# EAGLE design SuperPro (EAGLE 6.6.0)
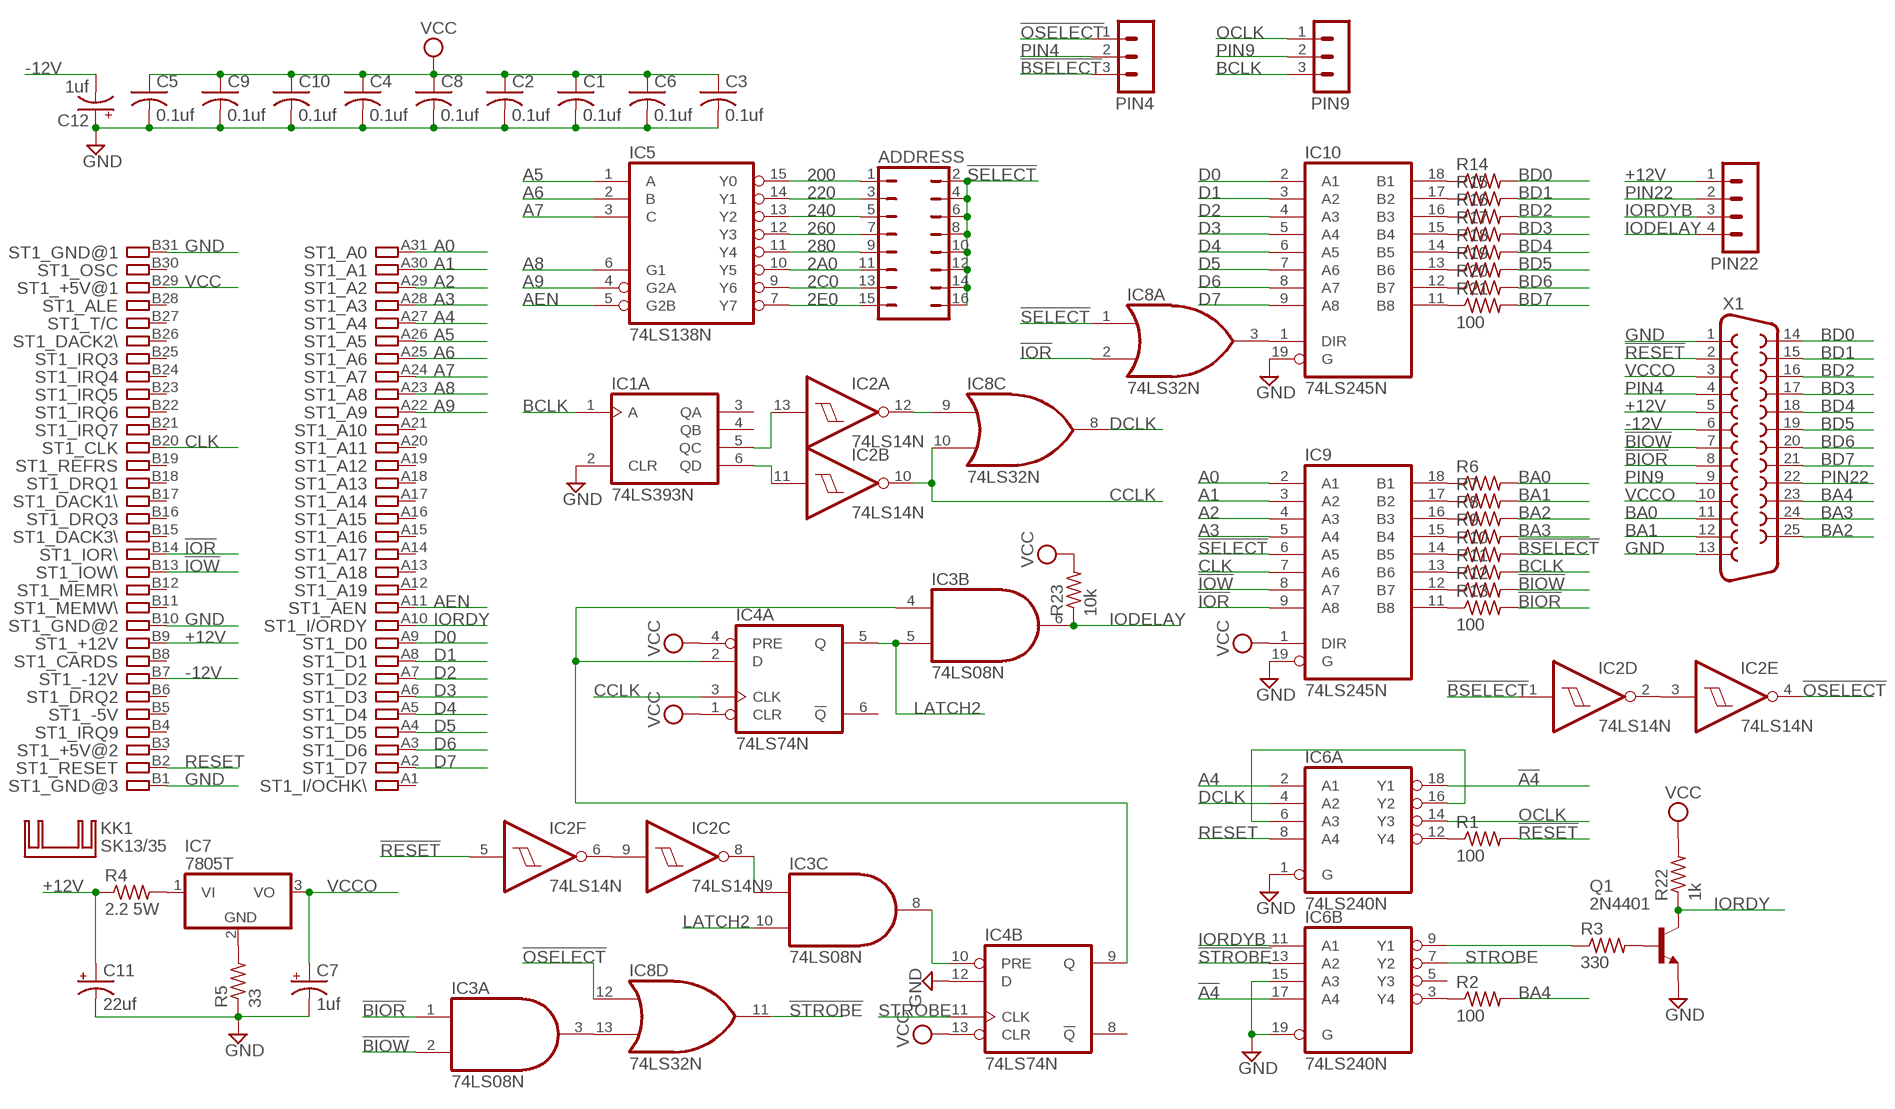
[diagram p0: schematic, sheet 1]

## Parts
ADDRESS  JP8Q  [JP8Q]
C1  0.1uf  C-US050-025X075  [C050-025X075]
C2  0.1uf  C-US050-025X075  [C050-025X075]
C3  0.1uf  C-US050-025X075  [C050-025X075]
C4  0.1uf  C-US050-025X075  [C050-025X075]
C5  0.1uf  C-US050-025X075  [C050-025X075]
C6  0.1uf  C-US050-025X075  [C050-025X075]
C7  1uf  CPOL-USE5-10.5  [E5-10,5]
C8  0.1uf  C-US050-025X075  [C050-025X075]
C9  0.1uf  C-US050-025X075  [C050-025X075]
C10  0.1uf  C-US050-025X075  [C050-025X075]
C11  22uf  CPOL-USE5-10.5  [E5-10,5]
C12  1uf  CPOL-USE5-10.5  [E5-10,5]
IC1  74LS393N  [DIL14]
IC2  74LS14N  [DIL14]
IC3  74LS08N  [DIL14]
IC4  74LS74N  [DIL14]
IC5  74LS138N  [DIL16]
IC6  74LS240N  [DIL20]
IC7  7805T  [TO220H]
IC8  74LS32N  [DIL14]
IC9  74LS245N  [DIL20]
IC10  74LS245N  [DIL20]
KK1  SK13/35  [SK13/35]
PIN4  MA03-1  [MA03-1]
PIN9  MA03-1  [MA03-1]
PIN22  MA04-1  [MA04-1]
Q1  2N4401  2N4416  [TO92]
R1  100  R-US_0207/10  [0207/10]
R2  100  R-US_0207/10  [0207/10]
R3  330  R-US_0207/10  [0207/10]
R4  2.2 5W  R-US_0922/22  [0922/22]
R5  33  R-US_0207/10  [0207/10]
R6  R-US_0207/10  [0207/10]
R7  R-US_0207/10  [0207/10]
R8  R-US_0207/10  [0207/10]
R9  R-US_0207/10  [0207/10]
R10  R-US_0207/10  [0207/10]
R11  R-US_0207/10  [0207/10]
R12  R-US_0207/10  [0207/10]
R13  100  R-US_0207/10  [0207/10]
R14  R-US_0207/10  [0207/10]
R15  R-US_0207/10  [0207/10]
R16  R-US_0207/10  [0207/10]
R17  R-US_0207/10  [0207/10]
R18  R-US_0207/10  [0207/10]
R19  R-US_0207/10  [0207/10]
R20  R-US_0207/10  [0207/10]
R21  100  R-US_0207/10  [0207/10]
R22  1k  R-US_0207/10  [0207/10]
R23  10k  R-US_0207/10  [0207/10]
ST1  IBM8BIT  [IBM8BIT]
X1  F25H  [F25H]

## Nets
2A0: ADDRESS.11 IC5.10(Y5)
2C0: ADDRESS.13 IC5.9(Y6)
2E0: ADDRESS.15 IC5.7(Y7)
200: ADDRESS.1 IC5.15(Y0)
220: ADDRESS.3 IC5.14(Y1)
240: ADDRESS.5 IC5.13(Y2)
260: ADDRESS.7 IC5.12(Y3)
280: ADDRESS.9 IC5.11(Y4)
!A4: IC6.17(B:A4) IC6.18(A:Y1)
!BIOR: IC3.1(A:I0) R13.2 X1.8
!BIOW: IC3.2(A:I1) R12.2 X1.7
!BSELECT: IC2.1(D:I) PIN4.3 R10.2
!IOR: IC8.2(A:I1) IC9.9(A8) ST1.B14
!IOW: IC9.8(A7) ST1.B13
!OSELECT: IC2.4(E:O) IC8.12(D:I0) PIN4.1
!RESET: IC2.5(F:I) R1.2 X1.2
!SELECT: ADDRESS.2 ADDRESS.4 ADDRESS.6 ADDRESS.8 ADDRESS.10 ADDRESS.12 ADDRESS.14 ADDRESS.16 IC8.1(A:I0) IC9.6(A5)
!STROBE: IC6.13(B:A2) IC8.11(D:O)
+12V [Power]: C11.+ PIN22.1 R4.1 ST1.B9 X1.5
-12V [Power]: C12.- ST1.B7 X1.6
A0: IC9.2(A1) ST1.A31
A1: IC9.3(A2) ST1.A30
A2: IC9.4(A3) ST1.A29
A3: IC9.5(A4) ST1.A28
A4: IC6.2(A:A1) ST1.A27
A5: IC5.1(A) ST1.A26
A6: IC5.2(B) ST1.A25
A7: IC5.3(C) ST1.A24
A8: IC5.6(G1) ST1.A23
A9: IC5.4(G2A) ST1.A22
AEN: IC5.5(G2B) ST1.A11
BA0: R6.2 X1.11
BA1: R7.2 X1.12
BA2: R8.2 X1.25
BA3: R9.2 X1.24
BA4: R2.2 X1.23
BCLK: IC1.1(A:A) PIN9.3 R11.2
BD0: R14.2 X1.14
BD1: R15.2 X1.15
BD2: R16.2 X1.16
BD3: R17.2 X1.17
BD4: R18.2 X1.18
BD5: R19.2 X1.19
BD6: R20.2 X1.20
BD7: R21.2 X1.21
CCLK: IC2.10(B:O) IC4.3(A:CLK) IC8.10(C:I1)
CLK: IC9.7(A6) ST1.B20
D0: IC10.2(A1) ST1.A9
D1: IC10.3(A2) ST1.A8
D2: IC10.4(A3) ST1.A7
D3: IC10.5(A4) ST1.A6
D4: IC10.6(A5) ST1.A5
D5: IC10.7(A6) ST1.A4
D6: IC10.8(A7) ST1.A3
D7: IC10.9(A8) ST1.A2
DCLK: IC6.4(A:A2) IC8.8(C:O)
GND [Power]: C1.2 C2.2 C3.2 C4.2 C5.2 C6.2 C7.- C8.2 C9.2 C10.2 C11.- C12.+ IC1.2(A:CLR) IC4.12(B:D) IC6.1(A:G) IC6.15(B:A3) IC6.19(B:G) IC9.19(G) IC10.19(G) Q1.3(E) R5.1 ST1.B1 ST1.B10 ST1.B31 X1.1 X1.13
IODELAY: IC3.6(B:O) PIN22.4 R23.1
IORDY: Q1.1(C) R22.1 ST1.A10
IORDYB: IC6.11(B:A1) PIN22.3
LATCH2: IC3.5(B:I1) IC3.10(C:I1) IC4.5(A:Q)
N$1: IC8.3(A:O) IC10.1(DIR)
N$2 [Power]: IC7.2(GND) R5.2
N$3: IC10.13(B6) R19.1
N$4: IC10.17(B2) R15.1
N$5: IC10.16(B3) R16.1
N$6: IC10.15(B4) R17.1
N$7: IC10.14(B5) R18.1
N$8: IC10.12(B7) R20.1
N$9: IC10.11(B8) R21.1
N$10: IC10.18(B1) R14.1
N$11: IC9.18(B1) R6.1
N$12: IC9.17(B2) R7.1
N$13: IC9.16(B3) R8.1
N$14: IC9.15(B4) R9.1
N$15: IC9.14(B5) R10.1
N$16: IC9.13(B6) R11.1
N$17: IC9.12(B7) R12.1
N$18: IC9.11(B8) R13.1
N$19: IC6.12(A:Y4) R1.1
N$20: IC2.6(F:O) IC2.9(C:I)
N$21: IC2.2(D:O) IC2.3(E:I)
N$22: IC1.6(A:QD) IC2.11(B:I)
N$23: IC6.3(B:Y4) R2.1
N$24: IC1.5(A:QC) IC2.13(A:I)
N$25 [Power]: IC7.1(VI) R4.2
N$26: IC2.12(A:O) IC8.9(C:I0)
N$28: IC6.6(A:A3) IC6.16(A:Y2)
N$29: IC3.3(A:O) IC8.13(D:I1)
N$30: IC3.4(B:I0) IC4.2(A:D) IC4.9(B:Q)
N$32: IC6.9(B:Y1) R3.1
N$33: IC3.8(C:O) IC4.10(B:PRE)
N$34: IC2.8(C:O) IC3.9(C:I0)
N$37: Q1.2(B) R3.2
OCLK: IC6.14(A:Y3) PIN9.1
PIN4: PIN4.2 X1.4
PIN9: PIN9.2 X1.9
PIN22 [Power]: PIN22.2 X1.22
RESET: IC6.8(A:A4) ST1.B2
STROBE: IC4.11(B:CLK) IC6.7(B:Y2)
VCC [Power]: C1.1 C2.1 C3.1 C4.1 C5.1 C6.1 C8.1 C9.1 C10.1 IC4.1(A:CLR) IC4.4(A:PRE) IC4.13(B:CLR) IC9.1(DIR) R22.2 R23.2 ST1.B29
VCCO [Power]: C7.+ IC7.3(VO) X1.3 X1.10
Unconnected: IC1.3(A:QA) IC1.4(A:QB) IC1.8(B:QD) IC1.9(B:QC) IC1.10(B:QB) IC1.11(B:QA) IC1.12(B:CLR) IC1.13(B:A) IC3.11(D:O) IC3.12(D:I0) IC3.13(D:I1) IC4.6(A:!Q) IC4.8(B:!Q) IC6.5(B:Y3) IC8.4(B:I0) IC8.5(B:I1) IC8.6(B:O) ST1.A1 ST1.A12 ST1.A13 ST1.A14 ST1.A15 ST1.A16 ST1.A17 ST1.A18 ST1.A19 ST1.A20 ST1.A21 ST1.B3 ST1.B4 ST1.B5 ST1.B6 ST1.B8 ST1.B11 ST1.B12 ST1.B15 ST1.B16 ST1.B17 ST1.B18 ST1.B19 ST1.B21 ST1.B22 ST1.B23 ST1.B24 ST1.B25 ST1.B26 ST1.B27 ST1.B28 ST1.B30

## Power pins joined to a net without a drawn wire
GND: IC1.7(P:GND) IC2.7(P:GND) IC3.7(P:GND) IC4.7(P:GND) IC5.8(GND) IC6.10(P:GND) IC8.7(P:GND) IC9.10(GND) IC10.10(GND)
VCC: IC1.14(P:VCC) IC2.14(P:VCC) IC3.14(P:VCC) IC4.14(P:VCC) IC5.16(VCC) IC6.20(P:VCC) IC8.14(P:VCC) IC9.20(VCC) IC10.20(VCC)

## Library data of the parts
ADDRESS = jumper:JP8Q: JUMPER
C1-C6 C8-C10 = rcl:C-US: CAPACITOR, American symbol
C7 C11 C12 = rcl:CPOL-US: POLARIZED CAPACITOR, American symbol
IC1 = 74xx-us:74*393: Dual 4-bit decade and binary COUNTER
IC2 = 74xx-us:74*14: Hex schmitt trigger INVERTER
IC3 = 74xx-us:74*08: Quad 2-input AND gate
IC4 = 74xx-us:74*74: Dual D type positive edge triggered FLIP FLOP, preset and clear
IC5 = 74xx-us:74*138: 3-line to 8-line DECODER/DEMULTIPLEXER
IC6 = 74xx-us:74*240: Octal BUFFER and LINE DRIVER, 3-state
IC7 = linear:78*: Positive VOLTAGE REGULATOR Source: http://cache.national.com/ds/LM/LM78L05.pdf http://www.fairchildsemi.com/ds/LM/LM7805.pdf
IC8 = 74xx-us:74*32: Quad 2-input OR gate
IC9 IC10 = 74xx-us:74*245: Octal BUS TRANSCEIVER, 3-state
KK1 = heatsink:SK13/35: HEATSINK manufacturer Fischer/distributor Buerklin
PIN4 PIN9 = con-lstb:MA03-1: PIN HEADER; OC_FARNELL: unknown; OC_NEWARK: unknown
PIN22 = con-lstb:MA04-1: PIN HEADER; OC_FARNELL: unknown; OC_NEWARK: unknown
Q1 = transistor-npn:2N4416: NPN Transistor
R1-R23 = rcl:R-US_: RESISTOR, American symbol
ST1 = con-pc:IBM8BIT: 8-bit CARD IBM/PC-AT
X1 = con-subd:F25: SUB-D; OC_FARNELL: unknown; OC_NEWARK: unknown

## Net classes
1 Power: width 0.762 mm, clearance 0.254 mm

## Board
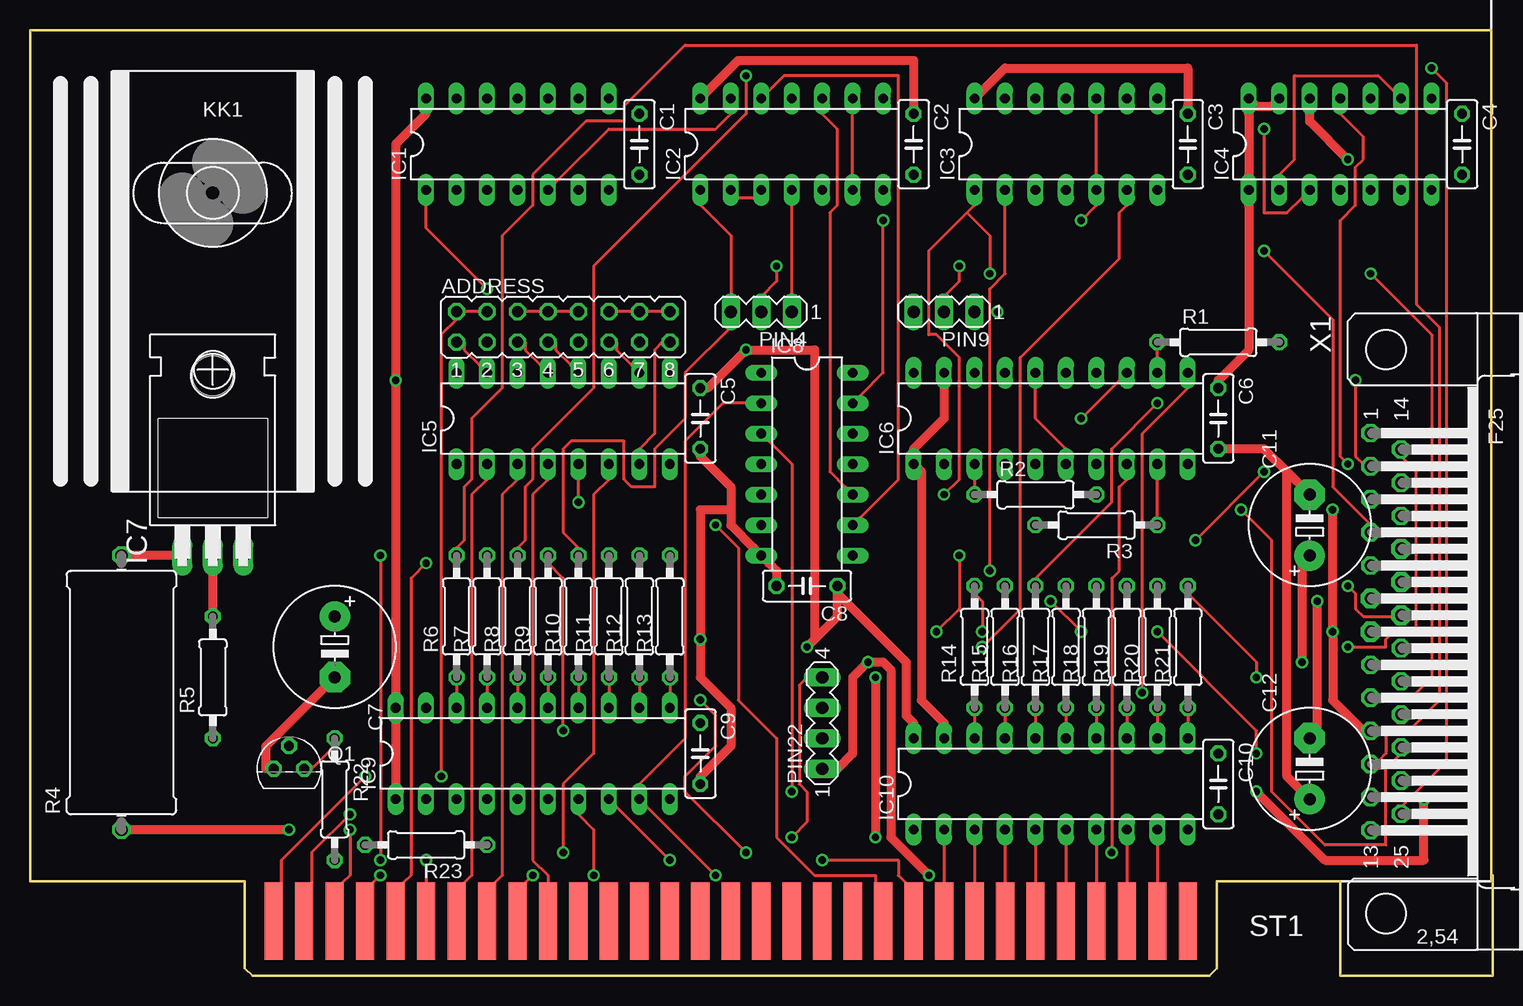
[diagram p1: board, top side]
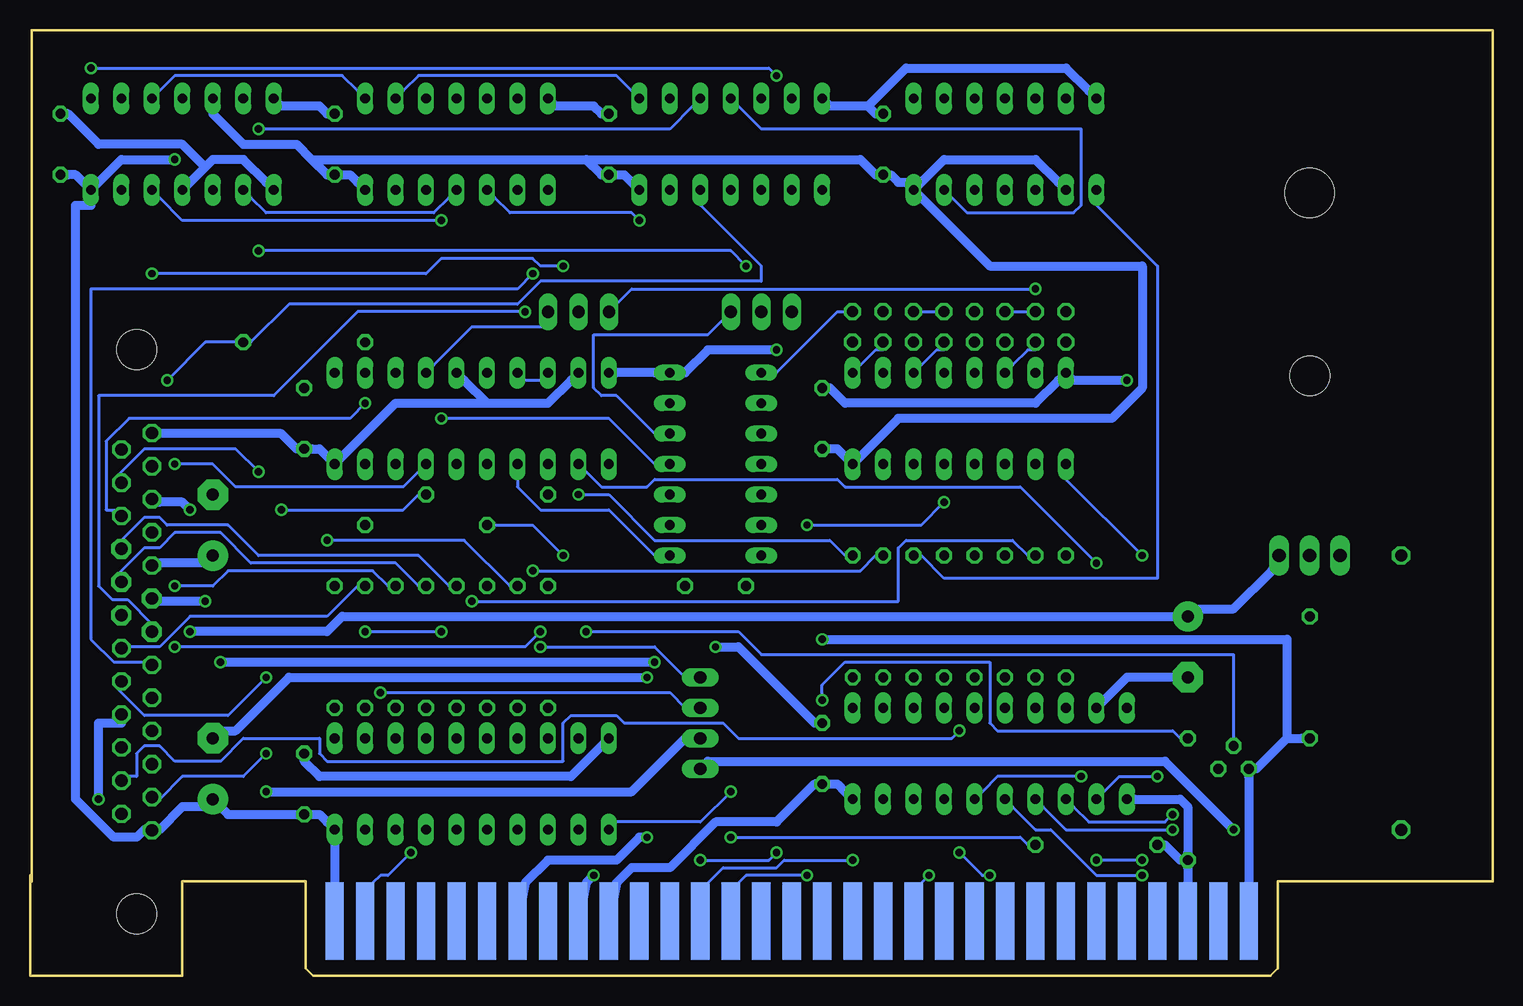
[diagram p2: board, bottom side, seen from below]

Size 121.92 x 78.87 mm. Coordinates in mm from the lower left corner, seen from the top.
Outline: 121.79,7.87 121.79,78.87 0,78.87 0,7.87 17.91,7.87 17.91,0.64 18.54,0 97.79,0 98.3,0 98.93,0.64 98.93,7.87 109.22,7.87 109.22,0 121.92,0 121.92,8.38
Copper layers (1*16): Top 0.035mm / dielectric 1.5mm / Bottom 0.035mm
Design rules "olimex10mil": minimum track width 10mil, minimum drill 24mil, track to track 10mil, track to pad 10mil, pad to pad 10mil, via to via 10mil, smd to smd 10mil, copper to edge 40mil, drill to drill 10mil, minimum pad ring 10mil, minimum via ring 8mil, stop-mask expansion 0mil, vias tented up to drill 0mil, thermal gap 10mil

### Footprints (pad centres in the part's own frame; a part is rotated, then mirrored left to right if it is on the bottom)
JP8Q = drill 0.914 octagon: 1 -8.89,-1.27; 2 -8.89,1.27; 3 -6.35,-1.27; 4 -6.35,1.27; 5 -3.81,-1.27; 6 -3.81,1.27; 7 -1.27,-1.27; 8 -1.27,1.27; 9 1.27,-1.27; 10 1.27,1.27; 11 3.81,-1.27; 12 3.81,1.27; 13 6.35,-1.27; 14 6.35,1.27; 15 8.89,-1.27; 16 8.89,1.27
C050-025X075 = drill 0.813 octagon: 1 -2.54,0; 2 2.54,0
E5-10,5 = drill 1.016 pad 2.54: + -2.54,0 | drill 1.016 pad 2.54 octagon: - 2.54,0
DIL14 = drill 0.813 long: 1 -7.62,-3.81; 2 -5.08,-3.81; 3 -2.54,-3.81; 4 0,-3.81; 5 2.54,-3.81; 6 5.08,-3.81; 7 7.62,-3.81; 8 7.62,3.81; 9 5.08,3.81; 10 2.54,3.81; 11 0,3.81; 12 -2.54,3.81; 13 -5.08,3.81; 14 -7.62,3.81
DIL16 = drill 0.813 long: 1 -8.89,-3.81; 2 -6.35,-3.81; 3 -3.81,-3.81; 4 -1.27,-3.81; 5 1.27,-3.81; 6 3.81,-3.81; 7 6.35,-3.81; 8 8.89,-3.81; 9 8.89,3.81; 10 6.35,3.81; 11 3.81,3.81; 12 1.27,3.81; 13 -1.27,3.81; 14 -3.81,3.81; 15 -6.35,3.81; 16 -8.89,3.81
DIL20 = drill 0.813 long: 1 -11.43,-3.81; 2 -8.89,-3.81; 3 -6.35,-3.81; 4 -3.81,-3.81; 5 -1.27,-3.81; 6 1.27,-3.81; 7 3.81,-3.81; 8 6.35,-3.81; 9 8.89,-3.81; 10 11.43,-3.81; 11 11.43,3.81; 12 8.89,3.81; 13 6.35,3.81; 14 3.81,3.81; 15 1.27,3.81; 16 -1.27,3.81; 17 -3.81,3.81; 18 -6.35,3.81; 19 -8.89,3.81; 20 -11.43,3.81
TO220H = drill 1.118 long: 1 -2.54,-10.16; 2 0,-10.16; 3 2.54,-10.16 | hole 3.302: 0,4.826
MA03-1 = drill 1.016 long: 1 -2.54,0; 2 0,0; 3 2.54,0
MA04-1 = drill 1.016 long: 1 -3.81,0; 2 -1.27,0; 3 1.27,0; 4 3.81,0
TO92 = drill 0.813 octagon: 1 1.27,0; 2 0,1.905; 3 -1.27,0
0207/10 = drill 0.813 octagon: 1 -5.08,0; 2 5.08,0
0922/22 = drill 1.016 octagon: 1 -11.43,0; 2 11.43,0
IBM8BIT = smd 1.524 x 6.477: A1 -25.4,5.08; A2 -27.94,5.08; A3 -30.48,5.08; A4 -33.02,5.08; A5 -35.56,5.08; A6 -38.1,5.08; A7 -40.64,5.08; A8 -43.18,5.08; A9 -45.72,5.08; A10 -48.26,5.08; A11 -50.8,5.08; A12 -53.34,5.08; A13 -55.88,5.08; A14 -58.42,5.08; A15 -60.96,5.08; A16 -63.5,5.08; A17 -66.04,5.08; A18 -68.58,5.08; A19 -71.12,5.08; A20 -73.66,5.08; A21 -76.2,5.08; A22 -78.74,5.08; A23 -81.28,5.08; A24 -83.82,5.08; A25 -86.36,5.08; A26 -88.9,5.08; A27 -91.44,5.08; A28 -93.98,5.08; A29 -96.52,5.08; A30 -99.06,5.08; A31 -101.6,5.08 | smd 1.524 x 6.477 bottom: B1 -25.4,5.08; B2 -27.94,5.08; B3 -30.48,5.08; B4 -33.02,5.08; B5 -35.56,5.08; B6 -38.1,5.08; B7 -40.64,5.08; B8 -43.18,5.08; B9 -45.72,5.08; B10 -48.26,5.08; B11 -50.8,5.08; B12 -53.34,5.08; B13 -55.88,5.08; B14 -58.42,5.08; B15 -60.96,5.08; B16 -63.5,5.08; B17 -66.04,5.08; B18 -68.58,5.08; B19 -71.12,5.08; B20 -73.66,5.08; B21 -76.2,5.08; B22 -78.74,5.08; B23 -81.28,5.08; B24 -83.82,5.08; B25 -86.36,5.08; B26 -88.9,5.08; B27 -91.44,5.08; B28 -93.98,5.08; B29 -96.52,5.08; B30 -99.06,5.08; B31 -101.6,5.08
4,1 = hole 4.1: 0,0
F25H = drill 1.016 octagon: 1 -16.561,-1.27; 2 -13.792,-1.27; 3 -11.049,-1.27; 4 -8.28,-1.27; 5 -5.512,-1.27; 8 2.769,-1.27; 9 5.512,-1.27; 10 8.28,-1.27; 11 11.049,-1.27; 12 13.792,-1.27; 13 16.561,-1.27; 14 -15.189,1.27; 15 -12.421,1.27; 16 -9.652,1.27; 20 1.372,1.27; 21 4.14,1.27; 22 6.909,1.27; 23 9.652,1.27; 24 12.421,1.27; 25 15.189,1.27 | drill 1.016 pad 1.67 octagon: 6 -2.769,-1.27; 7 0,-1.27; 17 -6.909,1.27; 18 -4.14,1.27; 19 -1.372,1.27 | hole 3.302: -23.52,0; 23.52,0

### Placement (x,y rotation side)
ADDRESS  44.45,54.1 0 top
C1  50.8,69.34 270 top
C2  73.66,69.34 270 top
C3  96.52,69.34 270 top
C4  119.38,69.34 270 top
C5  55.88,46.48 270 top
C6  99.06,46.48 270 top
C7  25.4,27.43 270 top
C8  64.77,32.51 180 top
C9  55.88,18.54 270 top
C10  99.06,16 270 top
C11  106.68,37.59 90 top
C12  106.68,17.27 90 top
IC1  40.64,69.34 0 top
IC2  63.5,69.34 0 top
IC3  86.36,69.34 0 top
IC4  109.22,69.34 0 top
IC5  44.45,46.48 0 top
IC6  85.09,46.48 0 top
IC7  15.24,45.21 0 top
IC8  64.77,42.67 270 top
IC9  41.91,18.54 0 top
IC10  85.09,16 0 top
KK1  15.24,61.72 90 top
PIN4  60.96,55.37 180 top
PIN9  76.2,55.37 180 top
PIN22  66.04,21.08 90 top
Q1  21.59,17.27 0 top
R1  99.06,52.83 0 top
R2  83.82,40.13 0 top
R3  88.9,37.59 180 top
R4  7.62,23.62 90 top
R5  15.24,24.89 90 top
R6  35.56,29.97 90 top
R7  38.1,29.97 90 top
R8  40.64,29.97 90 top
R9  43.18,29.97 90 top
R10  45.72,29.97 90 top
R11  48.26,29.97 90 top
R12  50.8,29.97 90 top
R13  53.34,29.97 90 top
R14  78.74,27.43 90 top
R15  81.28,27.43 90 top
R16  83.82,27.43 90 top
R17  86.36,27.43 90 top
R18  88.9,27.43 90 top
R19  91.44,27.43 90 top
R20  93.98,27.43 90 top
R21  96.52,27.43 90 top
R22  25.4,14.73 270 top
R23  33.02,10.92 180 top
ST1  121.92,-0.51 0 top
U$1  [4,1]  15.24,65.28 0 top
X1  113.03,28.7 270 top

### Tracks (layer width: path | path; a pad name or v marks a point on that pad's centre or on a via)
2A0
  Top 0.254: IC5.10 50.17,50.93 48.89,52.2 48.89,52.83 ADDRESS.11
2C0
  Bottom 0.254: IC5.9 52.7,50.93 51.44,52.2 50.8,52.2 ADDRESS.13
2E0
  Top 0.254: IC5.7 50.8,43.94 52.07,45.21 52.07,52.2 52.7,52.83 ADDRESS.15
200
  Top 0.254: IC5.15 37.47,50.93 36.2,52.2 36.2,52.83 ADDRESS.1
220
  Bottom 0.254: IC5.14 40,50.93 38.73,52.2 38.1,52.2 ADDRESS.3
240
  Top 0.254: IC5.13 42.55,50.93 41.28,52.2 41.28,52.83 ADDRESS.5
260
  Top 0.254: IC5.12 45.09,50.93 43.81,52.2 43.81,52.83 ADDRESS.7
280
  Bottom 0.254: IC5.11 47.62,50.93 46.36,52.2 45.72,52.2 ADDRESS.9
!A4
  Bottom 0.254: IC6.18 79.38,49.66 80.65,49.66 IC6.17
!BIOR  (via drill 0.61)
  Top 0.254: v76.2,40.13 77.47,41.4 77.47,51.56 75.56,53.47 74.93,53.47 74.93,60.45 78.11,63.63 | 78.11,63.63 78.74,64.26 IC3.1 | v80.01,58.55 80.01,61.72 78.11,63.63
  Bottom 0.254: v76.2,40.13 73.66,40.13 69.85,36.32 55.25,36.32 53.98,35.05 R13.2 | v80.01,58.55 81.28,57.28 116.84,57.28 116.84,28.07 114.94,26.16 112.39,26.16 X1.8
!BIOW  (via drill 0.61)
  Top 0.254: 80.01,55.37 80.01,57.28 81.28,58.55 81.28,64.26 IC3.2 | v80.01,33.78 80.01,55.37 | 80.01,55.37 v80.65,55.37
  Bottom 0.254: v80.01,33.78 52.7,33.78 51.44,35.05 R12.2 | v80.65,55.37 94.62,55.37 101.6,48.39 116.2,48.39 116.2,32.51 115.06,31.37 113.79,31.37 111.76,29.34 X1.7
!BSELECT
  Top 0.254: R10.2 45.72,35.69 44.45,36.96 44.45,43.94 45.09,44.58 49.53,44.58 49.53,41.4 50.17,40.77 52.07,40.77 52.07,43.94 54.61,46.48 54.61,50.29 58.42,54.1 PIN4.3 58.42,56.64 58.42,61.72 55.88,64.26 IC2.1
!IOR  (via drill 0.61)
  Top 0.254: IC8.2 59.69,47.75 57.78,47.75 54.61,44.58 54.61,19.81 50.8,16 IC9.9 51.44,14.1 v57.15,8.38
  Bottom 0.254: v57.15,8.38 62.23,8.38 62.87,7.75 ST1.B14
!IOW  (via drill 0.61)
  Top 0.254: v53.34,9.65 48.89,14.1 IC9.8
  Bottom 0.254: v53.34,9.65 59.05,9.65 59.69,9.02 64.14,9.02 65.41,7.75 ST1.B13
!OSELECT
  Top 0.254: IC2.4 63.5,64.26 63.5,56.64 PIN4.1
  Bottom 0.254: IC8.12 69.85,45.21 73.03,48.39 74.3,48.39 74.93,49.02 74.93,53.47 65.41,53.47 64.14,54.74 PIN4.1
!RESET  (via drill 0.61)
  Top 0.254: v110.49,49.66 110.49,43.31 111.12,42.67 X1.2
  Bottom 0.254: IC2.5 66.04,64.26 60.96,59.18 60.96,57.91 79.38,57.91 81.28,56.01 100.33,56.01 103.5,52.83 R1.2 104.78,52.83 107.31,52.83 v110.49,49.66
!SELECT  (via drill 0.61)
  Top 0.254: v34.29,16.64 34.29,53.47 35.56,54.74 ADDRESS.2 36.2,55.37 37.47,55.37 ADDRESS.4 | ADDRESS.6 41.28,55.37 42.55,55.37 ADDRESS.8 43.81,55.37 45.09,55.37 ADDRESS.10 | ADDRESS.12 48.89,55.37 50.17,55.37 ADDRESS.14 51.44,55.37 52.7,55.37 ADDRESS.16
  Bottom 0.254: IC8.1 59.69,50.29 54.61,55.37 53.98,55.37 ADDRESS.16 | v34.29,16.64 41.28,16.64 42.55,15.37 IC9.6 | ADDRESS.6 40,55.37 38.73,55.37 ADDRESS.4 | ADDRESS.12 47.62,55.37 46.36,55.37 ADDRESS.10
!STROBE  (via drill 0.61)
  Top 0.254: v87.63,46.48 90.81,49.66 IC6.13
  Bottom 0.254: v87.63,46.48 73.66,46.48 69.85,42.67 IC8.11
+12V  (via drill 0.61)
  Top 0.762: v21.59,12.19 8.25,12.19 R4.1 | v106.05,26.16 106.05,34.42 C11.+ | PIN22.1 67.31,17.27 68.58,18.54 68.58,24.89 v69.85,26.16 71.12,26.16 71.75,25.53 71.75,11.56 v74.93,8.38
  Bottom 0.762: X1.5 111.12,34.42 107.31,34.42 C11.+ | v21.59,12.19 27.31,17.91 65.41,17.91 PIN22.1 | v106.05,26.16 v69.85,26.16 | v74.93,8.38 75.56,7.75 ST1.B9
-12V  (via drill 0.61)
  Top 0.762: v107.31,31.24 107.31,20.45 C12.- | v70.48,24.89 v70.48,11.56
  Bottom 0.762: v107.31,31.24 111.12,31.24 X1.6 | v70.48,11.56 71.12,11.56 73.03,9.65 78.74,9.65 80.65,7.75 ST1.B7 | v70.48,24.89 100.33,24.89 104.78,20.45 106.05,20.45 C12.-
A0  (via drill 0.61)
  Top 0.254: v27.94,16.64 20.95,9.65 20.95,7.75 ST1.A31
  Bottom 0.254: v27.94,16.64 31.11,16.64 32.39,15.37 IC9.2
A1  (via drill 0.61)
  Top 0.254: v26.67,13.46 23.5,10.29 23.5,7.75 ST1.A30
  Bottom 0.254: v26.67,13.46 27.31,12.83 33.66,12.83 34.92,14.1 IC9.3
A2  (via drill 0.61)
  Top 0.254: v26.67,12.19 26.67,8.38 26.03,7.75 ST1.A29
  Bottom 0.254: v26.67,12.19 35.56,12.19 37.47,14.1 IC9.4
A3  (via drill 0.61)
  Top 0.254: v29.21,8.38 28.58,7.75 ST1.A28
  Bottom 0.254: v29.21,8.38 33.02,8.38 36.83,12.19 38.1,12.19 40,14.1 IC9.5
A4  (via drill 0.61)
  Top 0.254: v33.02,34.42 31.75,33.15 31.75,8.38 31.11,7.75 ST1.A27
  Bottom 0.254: v33.02,34.42 39.37,40.77 53.98,40.77 54.61,41.4 69.85,41.4 70.48,40.77 74.3,40.77 75.56,42.04 IC6.2
A5  (via drill 0.61)
  Top 0.254: v29.21,35.05 v29.21,9.65 | v33.02,9.65 33.02,7.75 ST1.A26
  Bottom 0.254: v29.21,35.05 35.56,41.4 IC5.1 | v29.21,9.65 v33.02,9.65
A6
  Top 0.254: IC5.2 38.1,41.4 36.83,40.13 36.83,8.38 36.2,7.75 ST1.A25
A7
  Top 0.254: IC5.3 40.64,41.4 39.37,40.13 39.37,8.38 38.73,7.75 ST1.A24
A8  (via drill 0.61)
  Top 0.254: v44.45,10.29 44.45,16 46.99,18.54 46.99,40.13 48.26,41.4 IC5.6 | v41.91,8.38 41.28,7.75 ST1.A23
  Bottom 0.254: v44.45,10.29 42.55,8.38 v41.91,8.38
A9
  Top 0.254: IC5.4 43.18,41.4 41.91,40.13 41.91,9.65 43.18,8.38 43.18,7.75 ST1.A22
AEN  (via drill 0.61)
  Top 0.254: v45.72,39.5 45.72,41.4 IC5.5 | v57.15,37.59 59.05,35.69 59.05,22.99 62.23,19.81 62.23,11.56 65.41,8.38 70.48,8.38 70.48,7.75 ST1.A11
  Bottom 0.254: v45.72,39.5 47.62,37.59 v57.15,37.59
BA0
  Top 0.254: R6.2 35.56,35.69 36.2,36.32 36.2,40.77 36.83,41.4 36.83,46.48 39.37,49.02 39.37,61.72 41.91,64.26 41.91,66.8 46.36,71.25 49.53,71.25 49.53,72.52 54.61,77.6 115.57,77.6 115.57,56.01 117.47,54.1 117.47,22.99 114.94,20.45 113.03,20.45 113.03,18.54 112.39,17.91 X1.11
BA1  (via drill 0.61)
  Top 0.254: v87.63,28.7 v85.09,31.24 | v93.98,28.7 102.23,20.45 v102.23,18.54
  Bottom 0.254: v85.09,31.24 49.53,31.24 49.53,35.69 48.89,36.32 40,36.32 38.73,35.05 R7.2 | v93.98,28.7 v87.63,28.7 | v102.23,18.54 104.14,16.64 109.22,16.64 111.12,14.73 X1.12
BA2  (via drill 0.61)
  Top 0.254: v59.69,75.06 59.69,71.88 46.99,59.18 46.99,49.02 41.91,43.94 41.91,41.4 41.28,40.77 41.28,36.32 40.64,35.69 R8.2 | v116.84,75.69 118.11,74.42 118.11,17.91 114.3,14.1 X1.25
  Bottom 0.254: v59.69,75.06 60.33,75.69 v116.84,75.69
BA3  (via drill 0.61)
  Top 0.254: v44.45,20.45 44.45,33.15 43.18,34.42 R9.2
  Bottom 0.254: v44.45,20.45 45.09,19.81 62.87,19.81 64.14,21.08 72.39,21.08 73.03,21.72 76.84,21.72 77.47,21.08 77.47,17.91 97.16,17.91 97.79,18.54 97.79,19.81 104.14,19.81 106.05,17.91 109.86,17.91 111.12,19.18 112.39,19.18 113.03,18.54 113.03,16.64 113.67,16.64 X1.24
BA4  (via drill 0.61)
  Top 0.254: v100.97,38.86 103.5,36.32 103.5,15.37 107.95,10.92 113.03,10.92 113.03,17.27 114.3,18.54 X1.23
  Bottom 0.254: v100.97,38.86 90.81,38.86 89.53,40.13 R2.2
BCLK  (via drill 0.61)
  Top 0.254: v38.1,57.28 33.02,62.36 33.02,64.26 IC1.1
  Bottom 0.254: IC1.1 33.02,64.26 27.94,59.18 27.94,33.15 45.72,33.15 47.62,35.05 R11.2 | v38.1,57.28 71.75,57.28 73.03,56.01 PIN9.3
BD0  (via drill 0.61)
  Top 0.254: v79.38,28.7 79.38,31.24 78.74,31.88 R14.2 | v109.86,27.43 113.03,27.43 113.03,28.07 113.67,28.7 115.57,28.7 115.57,42.04 114.3,43.31 X1.14
  Bottom 0.254: v79.38,28.7 80.65,27.43 v109.86,27.43
BD1  (via drill 0.61)
  Top 0.254: v97.16,36.32 v102.87,42.04
  Bottom 0.254: v97.16,36.32 85.72,36.32 81.91,32.51 R15.2 | v102.87,42.04 104.78,43.94 112.39,43.94 114.94,41.4 X1.15
BD2  (via drill 0.61)
  Top 0.254: v93.98,47.75 90.17,43.94 90.17,39.5 83.82,33.15 R16.2
  Bottom 0.254: v93.98,47.75 95.25,46.48 113.67,46.48 115.57,44.58 115.57,38.86 114.3,38.86 X1.16
BD3
  Bottom 0.254: R17.2 87,32.51 89.53,35.05 102.87,35.05 105.41,37.59 110.49,37.59 111.12,38.23 112.39,38.23 114.3,36.32 X1.17
BD4
  Bottom 0.254: R18.2 89.53,32.51 91.44,34.42 103.5,34.42 106.05,36.96 109.86,36.96 111.12,35.69 112.39,35.69 114.94,33.15 X1.18
BD5  (via drill 0.61)
  Top 0.254: v109.86,32.51 110.49,31.88 110.49,30.61 111.12,29.97 113.67,29.97 X1.19
  Bottom 0.254: v109.86,32.51 106.68,32.51 105.41,33.78 93.34,33.78 92.08,32.51 R19.2
BD6
  Bottom 0.254: R20.2 94.62,32.51 97.16,29.97 108.59,29.97 111.12,27.43 113.67,27.43 X1.20
BD7  (via drill 0.61)
  Top 0.254: v102.23,24.89 102.23,26.16 96.52,31.88 R21.2
  Bottom 0.254: v102.23,24.89 105.41,21.72 112.39,21.72 114.94,24.26 X1.21
CCLK  (via drill 0.61)
  Top 0.254: IC8.10 67.94,40.77 66.68,42.04 66.68,63.63 67.31,64.26 67.31,70.61 66.04,71.88 IC2.10 | v102.87,70.61 102.87,63.63 104.78,63.63 106.05,64.9 IC4.3
  Bottom 0.254: v102.87,70.61 68.58,70.61 66.68,72.52 IC2.10
CLK  (via drill 0.61)
  Top 0.254: v46.99,8.38 46.99,12.19 45.72,13.46 IC9.7
  Bottom 0.254: v46.99,8.38 47.62,7.75 ST1.B20
D0
  Top 0.254: IC10.2 76.2,10.92 76.2,7.75 ST1.A9
D1
  Top 0.254: IC10.3 78.74,10.92 78.74,7.75 ST1.A8
D2
  Top 0.254: IC10.4 81.28,10.92 81.28,7.75 ST1.A7
D3
  Top 0.254: IC10.5 83.82,10.92 83.82,7.75 ST1.A6
D4
  Top 0.254: IC10.6 86.36,10.92 86.36,7.75 ST1.A5
D5
  Top 0.254: IC10.7 88.9,10.92 88.9,7.75 ST1.A4
D6
  Top 0.254: IC10.8 91.44,10.92 91.44,7.75 ST1.A3
D7
  Top 0.254: IC10.9 93.98,10.92 93.98,7.75 ST1.A2
DCLK
  Bottom 0.254: IC8.8 69.85,35.05 73.66,38.86 79.38,38.86 81.28,40.77 81.28,41.4 IC6.4
GND  (via drill 0.61)
  Top 0.762: C7.- 24.77,24.26 19.69,19.18 19.69,17.27 Q1.3 | C8.2 62.23,33.15 62.23,33.78 61.59,34.42 IC8.7 60.33,35.69 58.42,37.59 58.42,38.86 | 58.42,38.86 58.42,40.77 55.88,43.31 C5.2 | 58.42,38.86 55.88,38.86 v55.88,28.07 55.88,24.89 58.42,22.35 58.42,19.18 55.88,16.64 C9.2 | 104.78,42.04 102.87,43.94 99.69,43.94 C6.2 | 104.78,42.04 106.05,40.77 C11.- | IC6.19 76.2,49.02 76.2,46.48 73.66,43.94 IC6.1 74.3,42.04 74.3,22.99 76.2,21.08 IC10.19 | 104.78,42.04 104.78,16.64 106.05,15.37 C12.+ | v109.86,68.07 106.68,71.25 106.68,71.88 IC4.12
  Bottom 0.762: IC9.19 32.39,22.99 30.48,24.89 26.03,24.89 C7.- | 17.14,19.81 19.69,17.27 Q1.3 20.32,16.64 20.32,7.75 ST1.B31 | 17.14,19.81 15.88,19.81 R5.1 | C5.2 55.25,43.94 54.61,43.94 53.98,43.31 IC5.8 52.7,43.31 49.53,46.48 31.75,46.48 29.21,49.02 29.21,59.18 41.91,59.18 47.62,64.9 IC1.7 | IC9.10 53.98,15.37 54.61,16 55.25,16 C9.2 56.52,16 59.69,12.83 64.77,12.83 68.58,9.02 71.75,9.02 73.03,7.75 ST1.B10 | 17.14,19.81 17.14,28.07 v55.88,28.07 | ST1.B1 96.52,7.75 96.52,10.92 IC10.10 97.16,12.83 97.79,13.46 98.42,13.46 C10.2 99.69,13.46 105.41,13.46 106.05,14.1 C12.+ 107.31,14.1 109.22,14.1 111.12,12.19 X1.13 112.39,12.19 113.03,11.56 114.94,11.56 118.11,14.73 118.11,64.26 116.84,64.26 IC4.7 | X1.1 111.12,45.21 100.97,45.21 99.69,43.94 C6.2 98.42,43.94 97.79,43.94 97.16,43.31 IC6.10 95.89,43.31 91.44,47.75 83.82,47.75 | 83.82,47.75 85.72,49.66 IC6.15 | 83.82,47.75 78.74,47.75 76.84,49.66 IC6.19 | IC1.2 36.2,66.17 38.1,68.07 45.72,68.07 47.62,66.17 IC1.7 | IC1.7 48.89,66.17 49.53,66.17 50.17,66.8 C1.2 51.44,66.8 52.7,68.07 75.56,68.07 | IC4.7 117.47,66.17 118.11,66.8 118.75,66.8 C4.2 | IC2.7 71.75,66.17 72.39,66.8 73.03,66.8 C2.2 74.3,66.8 75.56,68.07 | IC3.7 94.62,66.17 95.25,66.8 95.89,66.8 C3.2 97.16,66.8 98.42,68.07 | 98.42,68.07 99.69,69.34 104.14,69.34 106.68,71.88 IC4.12 | 98.42,68.07 75.56,68.07 | v109.86,68.07 114.3,68.07 116.2,66.17 IC4.7
IODELAY  (via drill 0.61)
  Top 0.254: v63.5,11.56 64.77,12.83 64.77,15.37 64.14,16 64.14,24.26 64.77,24.89 PIN22.4 | v79.38,27.43 82.55,30.61 82.55,51.56 90.81,59.82 90.81,63.63 91.44,64.26 IC3.6
  Bottom 0.254: v63.5,11.56 39.37,11.56 38.73,10.92 R23.1 | v79.38,27.43 69.85,27.43 67.31,24.89 PIN22.4
IORDY  (via drill 0.61)
  Top 0.254: Q1.1 23.5,17.27 25.4,19.18 R22.1 | v55.88,22.99 57.15,21.72 57.15,19.18 54.61,16.64 54.61,15.37 v59.69,10.29 | v66.04,9.65 72.39,9.65 72.39,8.38 73.03,7.75 ST1.A10
  Bottom 0.254: v55.88,22.99 55.88,24.26 53.98,26.16 41.91,26.16 41.91,21.08 41.28,20.45 26.67,20.45 26.03,19.81 R22.1 | v59.69,10.29 60.33,9.65 v66.04,9.65
IORDYB  (via drill 0.61)
  Top 0.254: v92.71,23.62 92.71,45.21 96.52,49.02 IC6.11
  Bottom 0.254: v92.71,23.62 68.58,23.62 67.31,22.35 PIN22.3
LATCH2  (via drill 0.61)
  Top 0.254: IC3.10 88.9,71.88 88.9,66.8 IC3.5 88.9,64.26 v87.63,62.99
  Bottom 0.254: v87.63,62.99 109.22,62.99 111.12,64.9 IC4.5
N$1  (via drill 0.61)
  Top 0.254: v63.5,15.37 63.5,42.67 61.59,44.58 IC8.3
  Bottom 0.254: v63.5,15.37 66.04,12.83 73.03,12.83 IC10.1
N$2
  Top 0.762: R5.2 15.24,30.61 15.24,33.78 IC7.2
N$3
  Top 0.254: IC10.13 91.44,21.08 91.44,21.72 R19.1
N$4
  Top 0.254: IC10.17 81.28,21.08 81.28,21.72 R15.1
N$5
  Top 0.254: IC10.16 83.82,21.08 83.82,21.72 R16.1
N$6
  Top 0.254: IC10.15 86.36,21.08 86.36,21.72 R17.1
N$7
  Top 0.254: IC10.14 88.9,21.08 88.9,21.72 R18.1
N$8
  Top 0.254: IC10.12 93.98,21.08 93.98,21.72 R20.1
N$9
  Top 0.254: IC10.11 96.52,21.08 96.52,21.72 R21.1
N$10
  Top 0.254: IC10.18 78.74,21.08 78.74,21.72 R14.1
N$11
  Top 0.254: IC9.18 35.56,23.62 35.56,24.26 R6.1
N$12
  Top 0.254: IC9.17 38.1,23.62 38.1,24.26 R7.1
N$13
  Top 0.254: IC9.16 40.64,23.62 40.64,24.26 R8.1
N$14
  Top 0.254: IC9.15 43.18,23.62 43.18,24.26 R9.1
N$15
  Top 0.254: IC9.14 45.72,23.62 45.72,24.26 R10.1
N$16
  Top 0.254: IC9.13 48.26,23.62 48.26,24.26 R11.1
N$17
  Top 0.254: IC9.12 50.8,23.62 50.8,24.26 R12.1
N$18
  Top 0.254: IC9.11 53.34,23.62 53.34,24.26 R13.1
N$19
  Top 0.254: IC6.12 93.98,51.56 93.98,52.2 R1.1
N$20
  Top 0.254: IC2.6 68.58,66.8 68.58,71.88 IC2.9
N$21
  Top 0.254: IC2.2 59.05,64.9 60.33,64.9 IC2.3
N$22
  Bottom 0.254: IC1.6 45.09,64.9 43.81,63.63 34.92,63.63 34.29,64.26 34.29,70.61 60.96,70.61 62.87,72.52 IC2.11
N$23
  Top 0.254: R2.1 78.74,40.77 78.74,41.4 IC6.3
N$24
  Top 0.254: IC1.5 43.81,66.17 48.26,70.61 57.15,70.61 58.42,71.88 IC2.13
N$25
  Top 0.762: R4.2 8.25,35.05 12.06,35.05 IC7.1
N$26
  Top 0.254: IC2.12 61.59,73.79 62.87,75.06 72.39,75.06 72.39,41.4 69.22,38.23 IC8.9
N$28
  Top 0.254: IC6.6 86.36,43.94 83.82,46.48 83.82,49.02 IC6.16
N$29  (via drill 0.61)
  Top 0.254: v71.12,62.99 71.12,50.29 69.22,48.39 IC8.13
  Bottom 0.254: v71.12,62.99 71.75,63.63 81.91,63.63 83.19,64.9 IC3.3
N$30
  Top 0.254: IC4.9 113.67,73.79 112.39,75.06 105.41,75.06 105.41,68.07 104.14,66.8 IC4.2
  Bottom 0.254: IC3.4 87,64.9 88.27,63.63 102.23,63.63 103.5,64.9 IC4.2
N$32
  Top 0.254: R3.1 93.98,38.23 93.98,41.4 IC6.9
N$33
  Bottom 0.254: IC3.8 94.62,73.79 95.89,75.06 109.86,75.06 111.12,73.79 IC4.10
N$34
  Bottom 0.254: IC2.8 71.75,73.79 73.03,75.06 89.53,75.06 90.81,73.79 IC3.9
N$37  (via drill 0.61)
  Top 0.254: v75.56,28.7 77.47,30.61 v77.47,35.05
  Bottom 0.254: v75.56,28.7 62.87,28.7 60.96,26.8 21.59,26.8 21.59,19.81 Q1.2 | v77.47,35.05 80.01,37.59 83.19,37.59 R3.2
OCLK
  Bottom 0.254: IC6.14 88.27,50.93 85.09,54.1 78.74,54.1 PIN9.1
PIN4  (via drill 0.61)
  Top 0.254: v62.23,59.18 62.23,57.91 60.96,56.64 PIN4.2 | v102.87,60.45 108.59,54.74 108.59,40.77 111.76,37.59 X1.4
  Bottom 0.254: v62.23,59.18 63.5,60.45 v102.87,60.45
PIN9  (via drill 0.61)
  Top 0.254: v77.47,59.18 77.47,57.91 76.2,56.64 PIN9.2 | v111.76,58.55 116.84,53.47 116.84,24.89 114.94,22.99 112.39,22.99 X1.9
  Bottom 0.254: v77.47,59.18 79.38,59.18 80.01,59.82 87.63,59.82 88.9,58.55 v111.76,58.55
PIN22  (via drill 0.61)
  Top 0.762: v102.23,15.37 107.95,9.65 116.2,9.65 v116.2,14.73
  Bottom 0.762: v102.23,15.37 71.75,15.37 67.31,19.81 PIN22.2 | v116.2,14.73 116.2,21.08 114.3,21.08 X1.22
RESET  (via drill 0.61)
  Top 0.254: v90.17,10.29 90.17,33.15 90.81,33.78 90.81,40.77 91.44,41.4 IC6.8
  Bottom 0.254: v90.17,10.29 92.08,8.38 92.71,8.38 93.34,7.75 ST1.B2
STROBE  (via drill 0.61)
  Top 0.254: v109.86,42.67 109.22,43.31 109.22,62.99 110.49,64.26 110.49,67.44 111.12,68.07 111.12,69.98 109.22,71.88 IC4.11
  Bottom 0.254: v109.86,42.67 106.68,42.67 104.78,40.77 90.81,40.77 89.53,42.04 IC6.7
VCC  (via drill 0.61)
  Top 0.762: C5.1 56.52,49.02 v59.69,52.2 65.41,52.2 65.41,28.07 | 65.41,28.07 67.31,29.97 67.31,31.88 | 65.41,28.07 v64.77,27.43 | 67.31,31.88 C8.1 67.31,31.88 | 67.31,31.88 73.03,26.16 73.03,21.72 73.66,21.08 IC10.20 | C6.1 99.06,49.66 101.6,52.2 101.6,64.26 IC4.1 101.6,66.8 101.6,71.88 IC4.14 102.23,72.52 103.5,72.52 IC4.13 | IC9.1 30.48,16 30.48,21.08 IC9.20 30.48,23.62 v30.48,49.66 30.48,69.34 33.02,71.88 IC1.14 | IC3.14 79.38,73.79 81.28,75.69 96.52,75.69 96.52,72.52 C3.1 | IC2.14 56.52,73.79 59.05,76.33 73.66,76.33 73.66,72.52 C2.1
  Bottom 0.762: IC6.20 73.03,50.29 69.85,50.29 IC8.14 67.31,50.29 65.41,52.2 v59.69,52.2 | C5.1 55.25,49.02 53.98,47.75 38.1,47.75 36.2,49.66 IC5.16 34.92,49.66 v30.48,49.66 | v64.77,27.43 62.87,27.43 56.52,21.08 C9.1 | C10.1 99.06,17.91 97.79,16.64 76.84,16.64 74.3,19.18 IC10.20 | 107.31,67.44 106.68,68.07 104.14,68.07 102.23,66.17 IC4.1 | 107.31,67.44 108.59,66.17 IC4.4 | 107.31,67.44 109.22,69.34 116.2,69.34 118.75,71.88 C4.1 | R22.2 25.4,9.02 25.4,7.75 ST1.B29 | R23.2 27.31,10.92 26.03,9.65 R22.2 | IC9.1 29.84,14.73 26.03,14.73 25.4,14.1 25.4,10.29 R22.2 | 52.07,72.52 51.44,71.88 C1.1 | 52.07,72.52 55.25,72.52 IC2.14 | 52.07,72.52 48.89,75.69 35.56,75.69 33.66,73.79 IC1.14 | C2.1 74.3,71.88 74.93,72.52 78.11,72.52 IC3.14 | C3.1 97.16,71.88 97.79,72.52 100.97,72.52 IC4.14
VCCO  (via drill 0.61)
  Top 0.762: v108.59,38.86 v108.59,28.7 108.59,22.99 111.12,20.45 X1.10
  Bottom 0.762: IC7.3 18.42,33.78 21.59,30.61 24.77,30.61 C7.+ 26.03,29.97 95.89,29.97 97.16,28.7 v108.59,28.7 | v108.59,38.86 109.22,39.5 111.12,39.5 X1.3